# Altium schematic sheet 主控.SchDoc: 主控
size A4; Organization: Altium Limited; Address1: L3, 12a Rodborough Rd; Address2: Frenchs Forest; Address3: NSW; Address4: Australia 2086; DocumentNumber: 4; Revision: V1.0; SheetNumber: 4; SheetTotal: 6; Designer: 樊浩柏
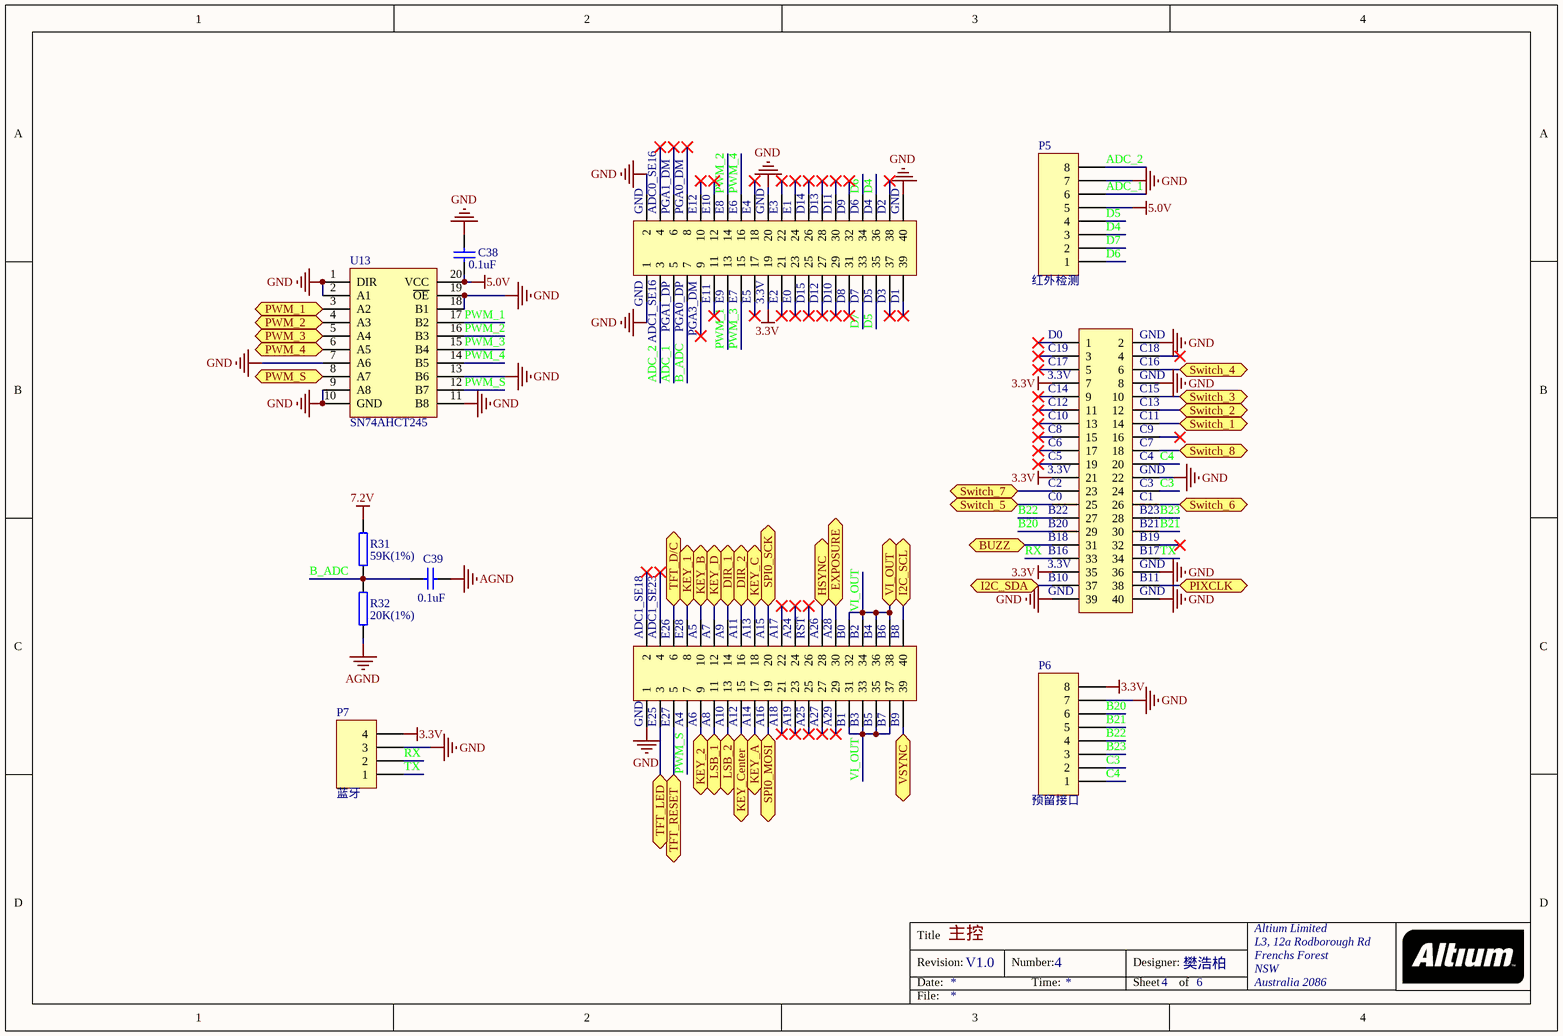
[diagram p0: 主控.SchDoc]

## Parts
C38  0.1uF  [CAP-0603]
C39  0.1uF  [CAP-0603]
CN1  CON-20X2  [Female-Header-2.00-Double-40]  (value not drawn)
CN2  CON-20X2  [Female-Header-2.00-Double-40]  (value not drawn)
CN3  CON-20X2  [Female-Header-2.00-Double-40]  (value not drawn)
P5  红外检测  [Header-FPC-ZIF-SMD-Vertical Single-0.5-8]
P6  预留接口  [Header-FPC-ZIF-SMD-Vertical Single-0.5-8]
P7  蓝牙  [Female-Header-2.54-Single-4]
R31  59K(1%)  [RES-0603]
R32  20K(1%)  [RES-0603]
U13  SN74AHCT245  [TSSOP-20]

## Ports
BUZZ, DIR_1, DIR_2, EXPOSURE, HSYNC, I2C_SCL, I2C_SDA, KEY_1, KEY_2, KEY_A, KEY_B, KEY_C, KEY_Center, KEY_D, LSB_1, LSB_2, PIXCLK, PWM_1, PWM_2, PWM_3, PWM_4, PWM_S, SPI0_MOSI, SPI0_SCK, Switch_1, Switch_2, Switch_3, Switch_4, Switch_5, Switch_6, Switch_7, Switch_8, TFT_D/C, TFT_LED, TFT_RESET, VI_OUT, VSYNC

## Nets
3.3V: CN1.19 CN2.7 CN2.21 CN2.35 P6.8 P7.4
5.0V: C38.2 P5.5 U13.20(VCC)
7.2V: R31.2
AGND: C39.2 R32.1
GND: C38.1 CN1.1 CN1.2 CN1.20 CN1.40 CN2.2 CN2.8 CN2.22 CN2.36 CN2.39 CN2.40 CN3.1 P5.7 P6.7 P7.3 U13.1(DIR) U13.2(A1) U13.7(A6) U13.9(A8) U13.10(GND) U13.11(B8) U13.13(B6) U13.18(B1) U13.19(~{OE})
ADC_1: CN1.5 P5.6
ADC_2: CN1.3 P5.8
B20: CN2.29 P6.6
B21: CN2.30 P6.5
B22: CN2.27 P6.4
B23: CN2.28 P6.3
B_ADC: C39.1 CN1.7 R31.1 R32.2
BUZZ: CN2.31 ; port BUZZ
C3: CN2.24 P6.2
C4: CN2.20 P6.1
D4: CN1.36 P5.3
D5: CN1.35 P5.4
D6: CN1.34 P5.1
D7: CN1.33 P5.2
DIR_1: CN3.14 ; port DIR_1
DIR_2: CN3.16 ; port DIR_2
EXPOSURE: CN3.30 ; port EXPOSURE
HSYNC: CN3.28 ; port HSYNC
I2C_SCL: CN3.40 ; port I2C_SCL
I2C_SDA: CN2.37 ; port I2C_SDA
KEY_1: CN3.8 ; port KEY_1
KEY_2: CN3.9 ; port KEY_2
KEY_A: CN3.17 ; port KEY_A
KEY_B: CN3.10 ; port KEY_B
KEY_C: CN3.18 ; port KEY_C
KEY_Center: CN3.15 ; port KEY_Center
KEY_D: CN3.12 ; port KEY_D
LSB_1: CN3.11 ; port LSB_1
LSB_2: CN3.13 ; port LSB_2
PIXCLK: CN2.38 ; port PIXCLK
PWM_1: U13.3(A2) ; port PWM_1
PWM_1: CN1.13 U13.17(B2)  [a separate net that carries the same name]
PWM_2: U13.4(A3) ; port PWM_2
PWM_2: CN1.14 U13.16(B3)  [a separate net that carries the same name]
PWM_3: U13.5(A4) ; port PWM_3
PWM_3: CN1.15 U13.15(B4)  [a separate net that carries the same name]
PWM_4: U13.6(A5) ; port PWM_4
PWM_4: CN1.16 U13.14(B5)  [a separate net that carries the same name]
PWM_S: U13.8(A7) ; port PWM_S
PWM_S: CN3.7 U13.12(B7)  [a separate net that carries the same name]
RX: CN2.33 P7.2
SPI0_MOSI: CN3.19 ; port SPI0_MOSI
SPI0_SCK: CN3.20 ; port SPI0_SCK
Switch_1: CN2.14 ; port Switch_1
Switch_2: CN2.12 ; port Switch_2
Switch_3: CN2.10 ; port Switch_3
Switch_4: CN2.6 ; port Switch_4
Switch_5: CN2.25 ; port Switch_5
Switch_6: CN2.26 ; port Switch_6
Switch_7: CN2.23 ; port Switch_7
Switch_8: CN2.18 ; port Switch_8
TFT_D/C: CN3.6 ; port TFT_D/C
TFT_LED: CN3.3 ; port TFT_LED
TFT_RESET: CN3.5 ; port TFT_RESET
TX: CN2.34 P7.1
VI_OUT: CN3.31 CN3.32 CN3.33 CN3.34 CN3.35 CN3.36 CN3.37 CN3.38 ; port VI_OUT
VSYNC: CN3.39 ; port VSYNC

Not connected (* = marked no-connect by the designer): CN1 4* 6* 8* 9* 10* 11* 12* 17* 18* 21* 22* 23* 24* 25* 26* 27* 28* 29* 30* 31* 32* 37* 38* 39*; CN2 1* 3* 4* 5* 9* 11* 13* 15* 16* 17* 19* 32*; CN3 2* 4* 21* 22* 23* 24* 25* 26* 27* 29*

## Notes on the sheet
- (near CN1) GND
- (near CN1) ADC0_SE16
- (near CN1) PGA1_DM
- (near CN1) PGA0_DM
- (near CN1) E12
- (near CN1) E10
- (near CN1) E8
- (near CN1) E6
- (near CN1) E4
- (near CN1) E3
- (near CN1) E1
- (near CN1) D14
- (near CN1) D13
- (near CN1) D11
- (near CN1) D9
- (near CN1) D6
- (near CN1) D4
- (near CN1) D2
- (near CN1) E11
- (near CN1) E9
- (near CN1) E7
- (near CN1) E5
- (near CN1) 3.3V
- (near CN1) E2
- (near CN1) E0
- (near CN1) D15
- (near CN1) D12
- (near CN1) D10
- (near CN1) D8
- (near CN1) D7
- (near CN1) D5
- (near CN1) D3
- (near CN1) D1
- (near CN1) ADC1_SE16
- (near CN1) PGA1_DP
- (near CN1) PGA0_DP
- (near CN1) PGA3_DM
- (near CN2) 3.3V
- (near CN2) D0
- (near CN2) C19
- (near CN2) C17
- (near CN2) GND
- (near CN2) C16
- (near CN2) C18
- (near CN2) C6
- (near CN2) C8
- (near CN2) C10
- (near CN2) C12
- (near CN2) C14
- (near CN2) C7
- (near CN2) C9
- (near CN2) C11
- (near CN2) C13
- (near CN2) C15
- (near CN2) C0
- (near CN2) C2
- (near CN2) C5
- (near CN2) B22
- (near CN2) C1
- (near CN2) C3
- (near CN2) C4
- (near CN2) B23
- (near CN2) B10
- (near CN2) B16
- (near CN2) B18
- (near CN2) B20
- (near CN2) B11
- (near CN2) B17
- (near CN2) B19
- (near CN2) B21
- (near CN3) ADC1_SE18
- (near CN3) ADC1_SE23
- (near CN3) E26
- (near CN3) E28
- (near CN3) A5
- (near CN3) A7
- (near CN3) A9
- (near CN3) A11
- (near CN3) A13
- (near CN3) A15
- (near CN3) A17
- (near CN3) A24
- (near CN3) RST
- (near CN3) A26
- (near CN3) A28
- (near CN3) B0
- (near CN3) B2
- (near CN3) B4
- (near CN3) B6
- (near CN3) B8
- (near CN3) GND
- (near CN3) E25
- (near CN3) E27
- (near CN3) A4
- (near CN3) A6
- (near CN3) A8
- (near CN3) A10
- (near CN3) A12
- (near CN3) A14
- (near CN3) A16
- (near CN3) A18
- (near CN3) A19
- (near CN3) A25
- (near CN3) A27
- (near CN3) A29
- (near CN3) B1
- (near CN3) B3
- (near CN3) B5
- (near CN3) B7
- (near CN3) B9
- Title
- Revision:
- Date:
- Number:
- Time:
- Designer:
- Sheet
- of
- File:

## Library data of the parts
C38 C39 = Cap
P5 P6 = CON-8X1
P7 = CON-4X1
R31 R32 = Res